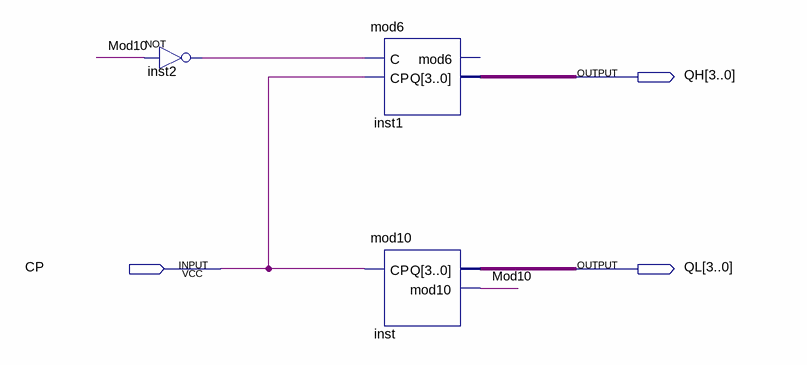
[diagram p0: schematic sheet]
// Quartus schematic mod60.bdf as structural Verilog: 3 symbols, 3 pins
module mod60 (
  input  CP,
  output [3:0] QH,
  output [3:0] QL
);

  wire inst2_out, Mod10;

  not inst2 (inst2_out, Mod10);
  mod6 inst1 (.C(inst2_out), .CP(CP), .Q(QH));  // open: mod6
  mod10 inst (.CP(CP), .Q(QL), .mod10(Mod10));
endmodule
